# EAGLE design v0 (EAGLE 9.6.2)
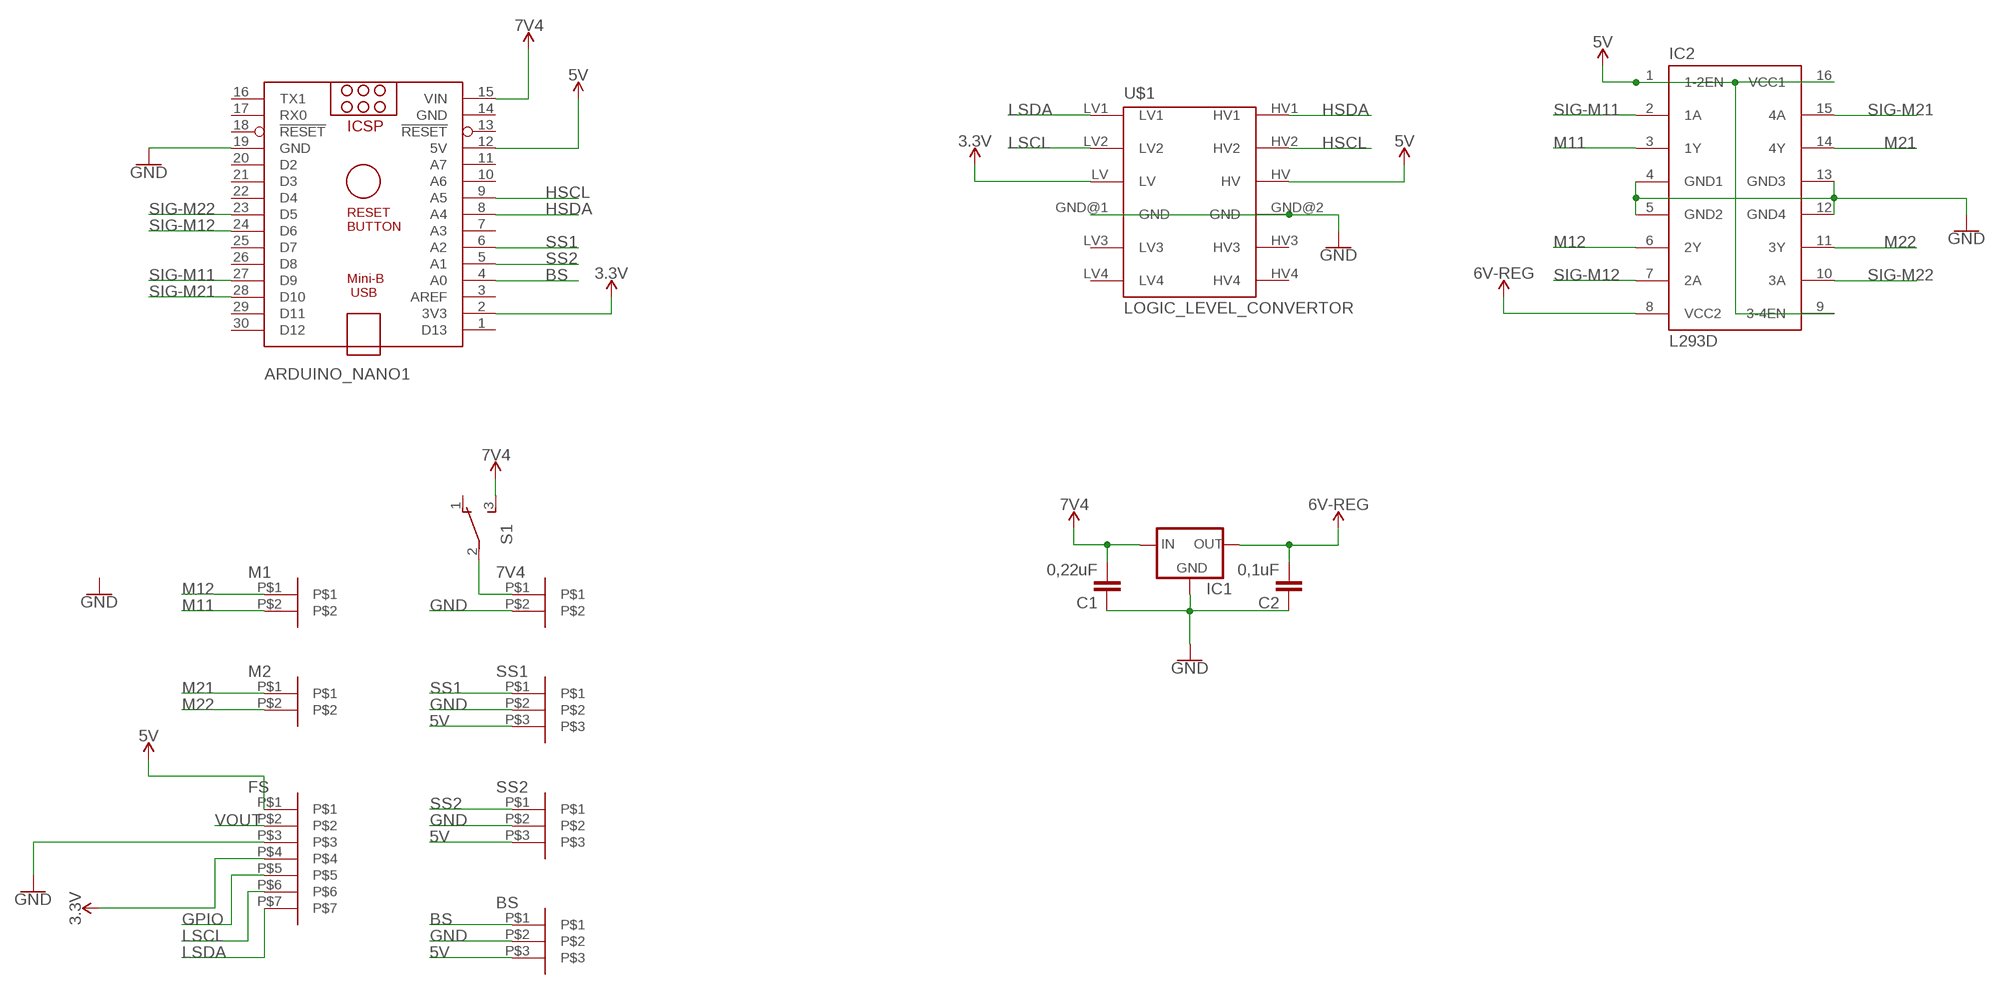
[diagram p0: schematic, sheet 1]

## Parts
7V4  2MM_JST_2  [2MM_JST_2]
ARDUINO_NANO1  ARDUINO_NANO  [ARDUINO_NANO]
BS  2MM_JST_3  [2MM_JST_3]
C1  0,22uF  C-EU050-025X075  [C050-025X075]
C2  0,1uF  C-EU050-025X075  [C050-025X075]
FS  2MM_JST_7  [2MM_JST_7]
IC1  78XXL  [78XXL]
IC2  L293D  [DIL16]
M1  2MM_JST_2  [2MM_JST_2]
M2  2MM_JST_2  [2MM_JST_2]
S1  TL36PO  [TL3XPO]
SS1  2MM_JST_3  [2MM_JST_3]
SS2  2MM_JST_3  [2MM_JST_3]
U$1  LOGIC_LEVEL_CONVERTOR  [LOGIC_LEVEL_CONVERTOR]

## Nets
3.3V: ARDUINO_NANO1.2(3V3) FS.P$4 U$1.LV
5V: ARDUINO_NANO1.12(5V) BS.P$3 FS.P$1 IC2.1(1-2EN) IC2.9(3-4EN) IC2.16(VCC1) SS1.P$3 SS2.P$3 U$1.HV
12V: C2.2 IC1.OUT IC2.8(VCC2) ; supply symbol labelled 6V-REG
BS: ARDUINO_NANO1.4(A0) BS.P$1
GND: 7V4.P$2 ARDUINO_NANO1.19(GND) BS.P$2 C1.1 C2.1 FS.P$3 IC1.GND IC2.4(GND1) IC2.5(GND2) IC2.12(GND4) IC2.13(GND3) SS1.P$2 SS2.P$2 U$1.GND@1(GND) U$1.GND@2(GND)
GPIO: FS.P$5
HSCL: ARDUINO_NANO1.9(A5) U$1.HV2
HSDA: ARDUINO_NANO1.8(A4) U$1.HV1
LSCL: FS.P$6 U$1.LV2
LSDA: FS.P$7 U$1.LV1
M11: IC2.3(1Y) M1.P$2
M12: IC2.6(2Y) M1.P$1
M21: IC2.14(4Y) M2.P$1
M22: IC2.11(3Y) M2.P$2
N$1: 7V4.P$1 S1.2(P)
SIG-M11: ARDUINO_NANO1.27(D9) IC2.2(1A)
SIG-M12: ARDUINO_NANO1.24(D6) IC2.7(2A)
SIG-M21: ARDUINO_NANO1.28(D10) IC2.15(4A)
SIG-M22: ARDUINO_NANO1.23(D5) IC2.10(3A)
SS1: ARDUINO_NANO1.6(A2) SS1.P$1
SS2: ARDUINO_NANO1.5(A1) SS2.P$1
VCCIO: ARDUINO_NANO1.15(VIN) C1.2 IC1.IN S1.3(S) ; supply symbol labelled 7V4
VOUT: FS.P$2
Unconnected: ARDUINO_NANO1.1(D13) ARDUINO_NANO1.3(AREF) ARDUINO_NANO1.7(A3) ARDUINO_NANO1.10(A6) ARDUINO_NANO1.11(A7) ARDUINO_NANO1.13(!RESET) ARDUINO_NANO1.16(TX1) ARDUINO_NANO1.17(RX0) ARDUINO_NANO1.18(!RESET) ARDUINO_NANO1.20(D2) ARDUINO_NANO1.21(D3) ARDUINO_NANO1.22(D4) ARDUINO_NANO1.25(D7) ARDUINO_NANO1.26(D8) ARDUINO_NANO1.29(D11) ARDUINO_NANO1.30(D12) S1.1(O) U$1.HV3 U$1.HV4 U$1.LV3 U$1.LV4

## Power pins joined to a net without a drawn wire
GND: ARDUINO_NANO1.14(GND)

## Library data of the parts
7V4 M1 M2 = JST:2MM_JST_2
ARDUINO_NANO1 = ArduinoNanoV30:ARDUINO_NANO: Arduino Nano V3.0 Overview: The Arduino Nano is a small, complete, and breadboard-friendly board based on the ATmega328 (Arduino Nano 3.x) or ATmega168 (Arduino Nano 2.x). It has more or less the same functionality of the Arduino Duemilanove, but in a different package. It lacks only a DC power jack, and works with a Mini-B USB cable instead of a standard one. The Nano was designed and is being produced by Gravitech. Specifications: Microcontroller Atmel ATmega168 or ATmega328 Operating Voltage (logic level) 5 V Input Voltage (recommended) 7-12 V Input Voltage (limits) 6-20 V Digital I/O Pins 14 (of which 6 provide PWM output) Analog Input Pins 8 DC Current per I/O Pin 40 mA Flash Memory 16 KB (ATmega168) or 32 KB (ATmega328) of which 2 KB used by bootloader SRAM 1 KB (ATmega168) or 2 KB (ATmega328) EEPROM 512 bytes (ATmega168) or 1 KB (ATmega328) Clock Speed 16 MHz Dimensions 0.73" x 1.70" Length 45 mm Width 18 mm Weigth 5 g Power: The Arduino Nano can be powered via the Mini-B USB connection, 6-20V unregulated external power supply (pin 30), or 5V regulated external power supply (pin 27). The power source is automatically selected to the highest voltage source. Memory: The ATmega168 has 16 KB of flash memory for storing code (of which 2 KB is used for the bootloader); the ATmega328 has 32 KB, (also with 2 KB used for the bootloader). The ATmega168 has 1 KB of SRAM and 512 bytes of EEPROM (which can be read and written with the EEPROM library); the ATmega328 has 2 KB of SRAM and 1 KB of EEPROM. Input and Output: Each of the 14 digital pins on the Nano can be used as an input or output, using pinMode(), digitalWrite(), and digitalRead() functions. They operate at 5 volts. Each pin can provide or receive a maximum of 40 mA and has an internal pull-up resistor (disconnected by default) of 20-50 kOhms. In addition, some pins have specialized functions. Visit Arduino - ArduinoBoardNano <https://www.arduino.cc/en/Main/ArduinoBoardNano>
BS SS1 SS2 = JST:2MM_JST_3
C1 C2 = rcl:C-EU: CAPACITOR, European symbol; SPICEPREFIX: C
FS = JST:2MM_JST_7
IC1 = v-reg:78XXL: VOLTAGE REGULATOR
IC2 = st-microelectronics:L293D: PUSH-PULL 4 CHANNEL DRIVER; MPN: L293D; OC_FARNELL: 9589619; OC_NEWARK: 56P8249
S1 = switch:TL36PO: TINY SWITCH ON - ON Source: http://www2.produktinfo.conrad.com/datenblaetter/700000-724999/705152-da-01-de-Subminiaturschalter_TL_36YO.pdf
U$1 = logic_level_convertor:LOGIC_LEVEL_CONVERTOR

## Board
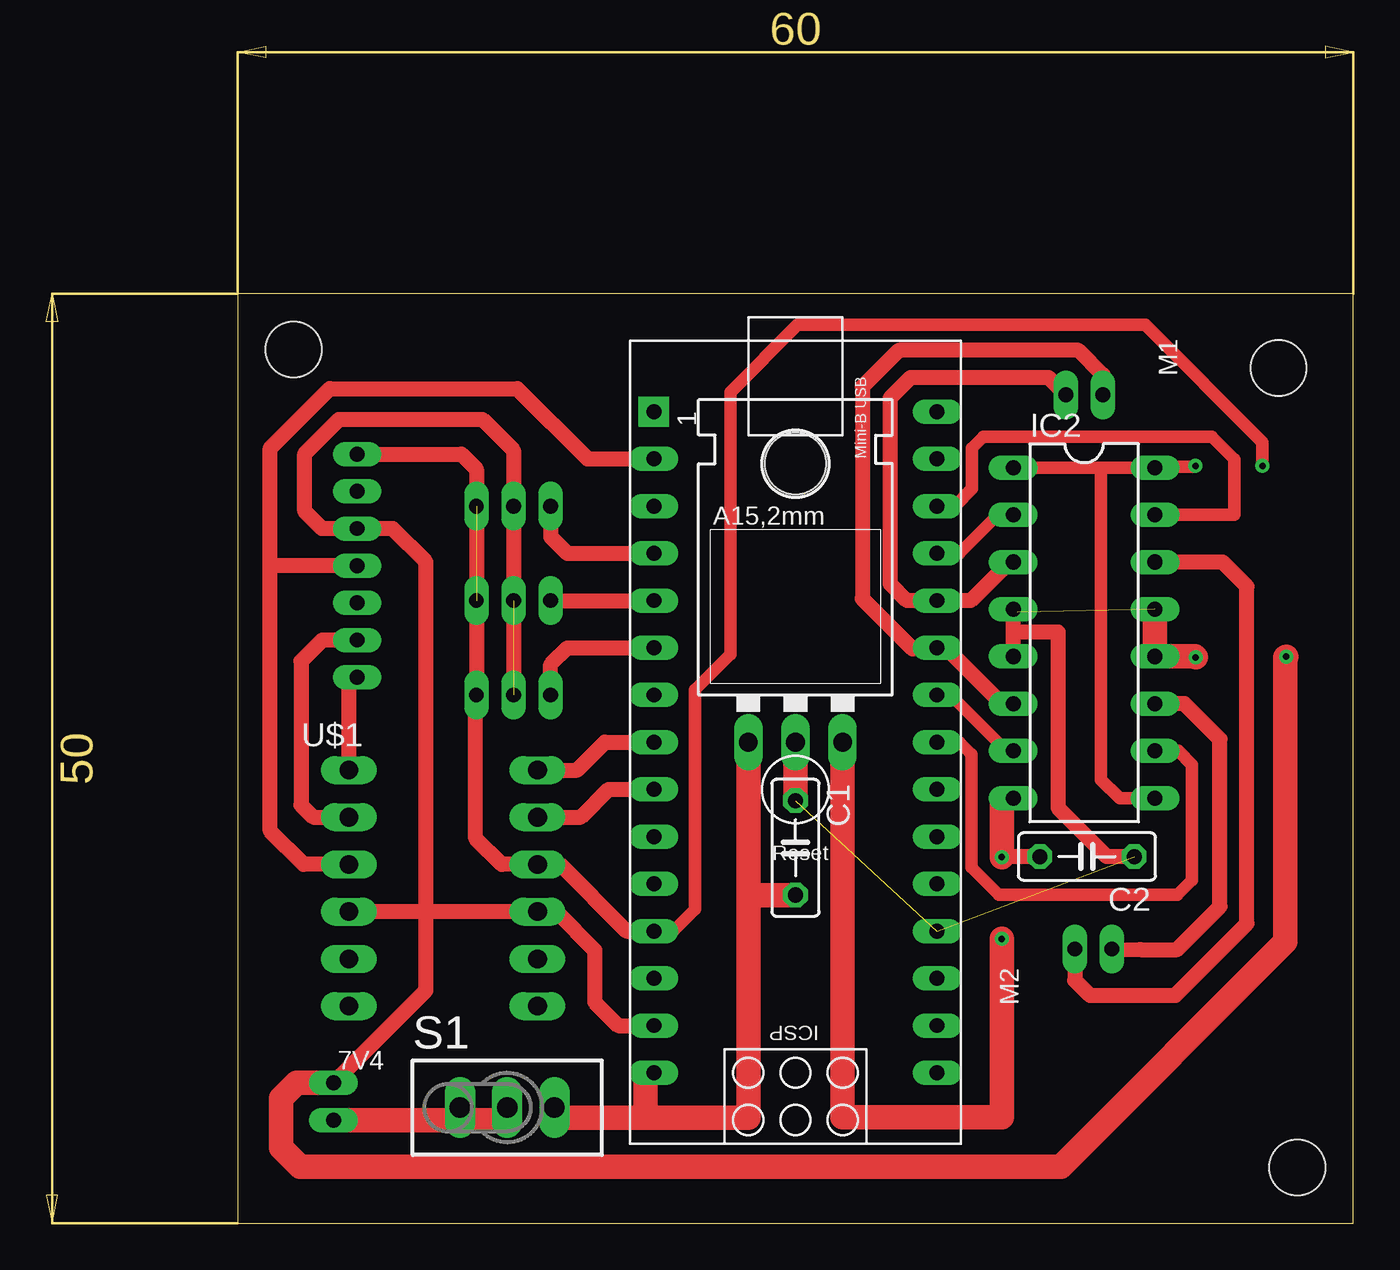
[diagram p1: board, top side]
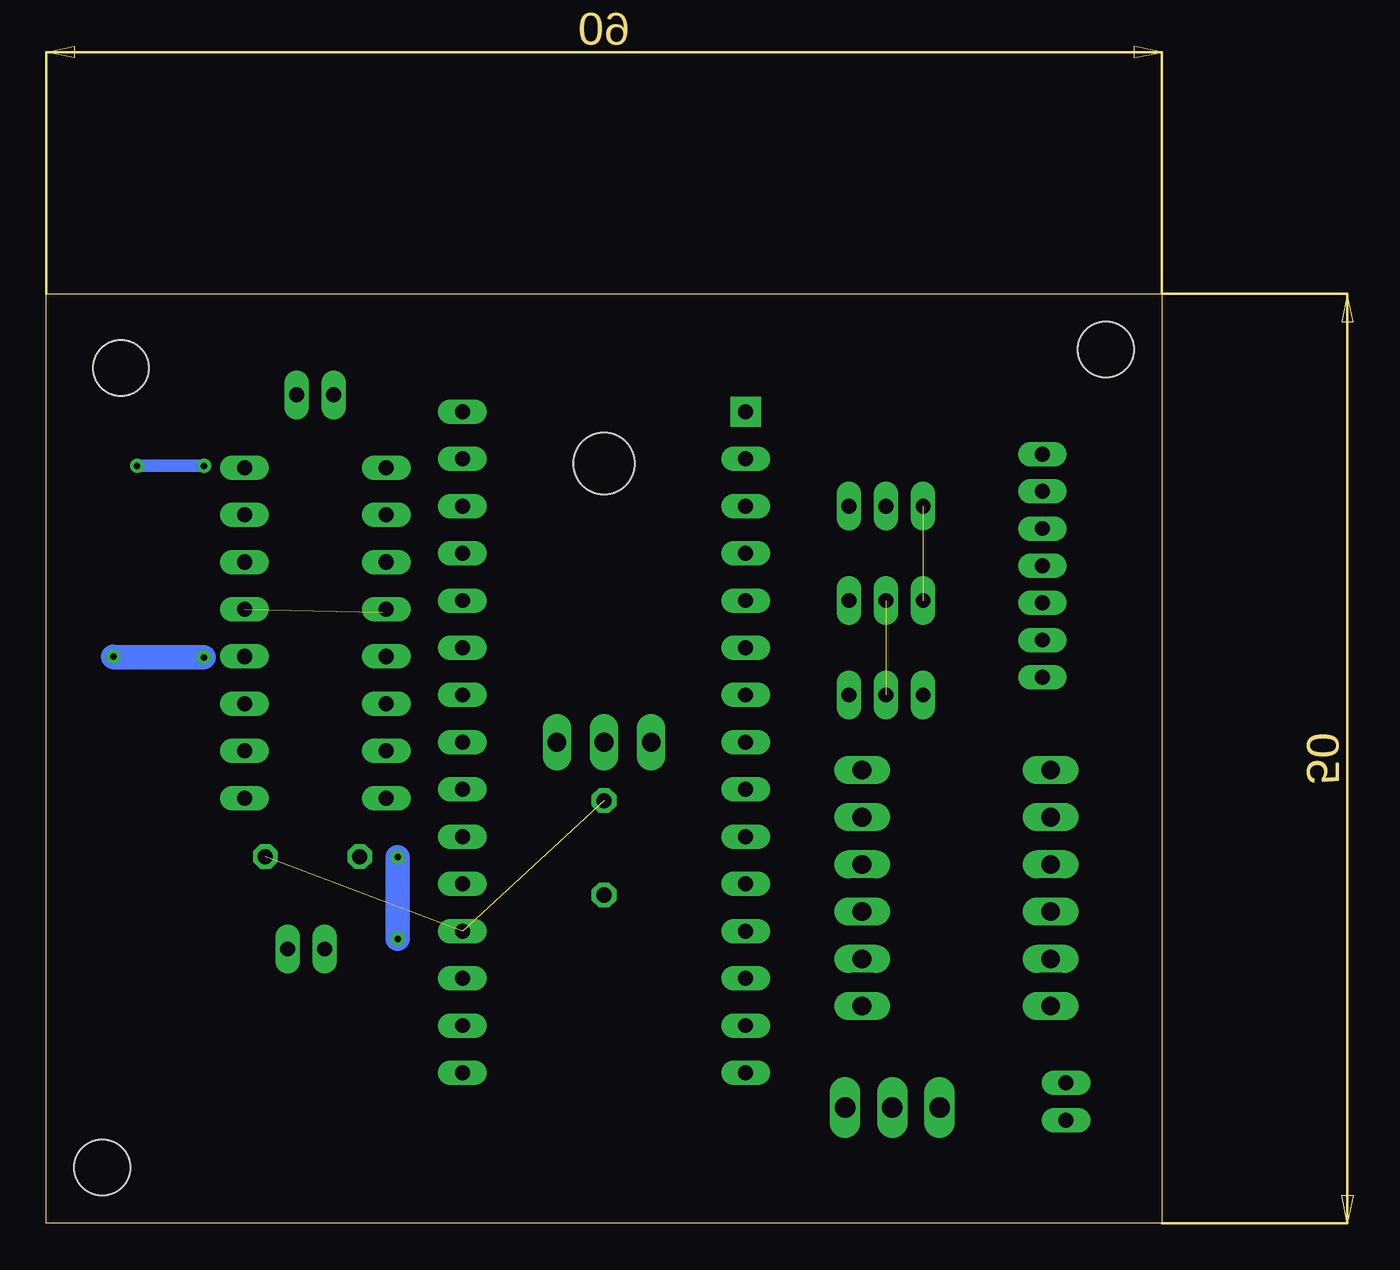
[diagram p2: board, bottom side, seen from below]

Size 60 x 50 mm. Coordinates in mm from the lower left corner, seen from the top.
Outline: 0,0 60,0 60,50 0,50 0,0
Copper layers (1*16): Top 0.035mm / dielectric 1.5mm / Bottom 0.035mm
Design rules "default": minimum track width 6mil, minimum drill 0.35mm, track to track 6mil, track to pad 6mil, pad to pad 6mil, via to via 6mil, smd to smd 6mil, copper to edge 40mil, drill to drill 6mil, minimum pad ring 10mil, minimum via ring 8mil, stop-mask expansion 4mil, vias tented up to drill 0mil, thermal gap 10mil
Holes 3 mm at 56,46 57,3 3,47

### Footprints (pad centres in the part's own frame; a part is rotated, then mirrored left to right if it is on the bottom)
2MM_JST_2 = drill 0.8 long: P$1 0,0; P$2 0,-2
ARDUINO_NANO = drill 0.8 pad 1.626 square: 1 -20.32,-7.62 | drill 0.8 long: 2 -17.78,-7.62; 3 -15.24,-7.62; 4 -12.7,-7.62; 5 -10.16,-7.62; 6 -7.62,-7.62; 7 -5.08,-7.62; 8 -2.54,-7.62; 9 0,-7.62; 10 2.54,-7.62; 11 5.08,-7.62; 12 7.62,-7.62; 13 10.16,-7.62; 14 12.7,-7.62; 15 15.24,-7.62; 16 15.24,7.62; 17 12.7,7.62; 18 10.16,7.62; 19 7.62,7.62; 20 5.08,7.62; 21 2.54,7.62; 22 0,7.62; 23 -2.54,7.62; 24 -5.08,7.62; 25 -7.62,7.62; 26 -10.16,7.62; 27 -12.7,7.62; 28 -15.24,7.62 | drill 0.8 pad 1.321 long: 29 -17.78,7.62; 30 -20.32,7.62
2MM_JST_3 = drill 0.8 long: P$1 0,0; P$2 0,-2; P$3 0,-4
C050-025X075 = drill 0.813 octagon: 1 -2.54,0; 2 2.54,0
2MM_JST_7 = drill 0.8 long: P$1 0,0; P$2 0,-2; P$3 0,-4; P$4 0,-6; P$5 0,-8; P$6 0,-10; P$7 0,-12
78XXL = drill 1.016 long: GND 0,-3.81; IN -2.54,-3.81; OUT 2.54,-3.81 | hole 3.302: 0,11.176
DIL16 = drill 0.813 long: 1 -8.89,-3.81; 2 -6.35,-3.81; 3 -3.81,-3.81; 4 -1.27,-3.81; 5 1.27,-3.81; 6 3.81,-3.81; 7 6.35,-3.81; 8 8.89,-3.81; 9 8.89,3.81; 10 6.35,3.81; 11 3.81,3.81; 12 1.27,3.81; 13 -1.27,3.81; 14 -3.81,3.81; 15 -6.35,3.81; 16 -8.89,3.81
TL3XPO = drill 1.1 pad 1.422 long: 1 -2.54,0; 2 0,0; 3 2.54,0
LOGIC_LEVEL_CONVERTOR = drill 1 long: GND@1 0,-7.62; GND@2 10.16,-7.62; HV 10.16,-5.08; HV1 10.16,0; HV2 10.16,-2.54; HV3 10.16,-10.16; HV4 10.16,-12.7; LV 0,-5.08; LV1 0,0; LV2 0,-2.54; LV3 0,-10.16; LV4 0,-12.7

### Placement (x,y rotation side)
7V4  5.15,5.55 180 top
ARDUINO_NANO1  30,23.34 270 top
BS  16.83,38.58 270 top
C1  30,20.2 270 top
C2  45.68,19.73 180 top
FS  6.42,41.37 0 top
IC1  30,29.69 0 top
IC2  45.53,31.76 270 top
M1  46.55,44.56 270 top
M2  45.02,14.75 90 top
S1  14.49,6.23 0 top
SS1  16.83,28.42 270 top
SS2  16.83,33.5 270 top
U$1  5.96,24.38 0 top

### Tracks (layer width: path | path; a pad name or v marks a point on that pad's centre or on a via)
3.3V
  Top 0.813: 1.74,35.4 1.74,41.7 4.94,44.9 15.03,44.9 18.81,41.12 ARDUINO_NANO1.2 | U$1.LV 3.54,19.3 1.74,21.1 1.74,35.4 | 1.74,35.4 1.77,35.37 FS.P$4
5V  (via drill 0.35)  (1 unrouted)
  Top 0.66: IC2.1 46.44,40.65 | 46.44,40.65 IC2.16 | 46.44,40.65 46.44,23.87 47.44,22.87 IC2.9 | ARDUINO_NANO1.12 23.42,15.72 24.6,16.9 24.6,28.7 26.5,30.6 26.5,44.7 30.12,48.32 48.82,48.32 55.12,42.02 v55.12,40.74 | IC2.16 47.46,40.65 | v51.52,40.74 51.47,40.69 49.38,40.69 IC2.16
  Top 0.813: ARDUINO_NANO1.12 20.91,15.72 17.33,19.3 U$1.HV 14.2,19.3 12.8,20.7 12.8,28.39 SS1.P$3 BS.P$3 12.83,40.57 12.03,41.37 FS.P$1
  Bottom 0.66: v51.52,40.74 v55.12,40.74
12V  (via drill 0.35)
  Top 0.813: C2.2 41.13,19.73 v41.1,19.7
  Top 1.321: IC2.8 41.1,22.87 v41.1,19.7 | v41.1,15.3 41.1,5.7 35,5.7 34.5,5.7 32.54,5.7 IC1.OUT
  Bottom 1.321: v41.1,19.7 v41.1,15.3
BS
  Top 0.813: ARDUINO_NANO1.4 17.71,36.04 16.83,36.92 BS.P$1
GND  (via drill 0.35)  (4 unrouted)
  Top 0.813: SS1.P$2 BS.P$2 14.83,41.57 13.16,43.24 5.44,43.24 3.6,41.4 3.6,38.3 4.53,37.37 FS.P$3 8.33,37.37 10.12,35.58 10.12,16.76 | ARDUINO_NANO1.14 20.46,10.64 19.2,11.9 19.2,14.7 17.14,16.76 U$1.GND@2 10.12,16.76 | 10.12,16.76 U$1.GND@1 | 7V4.P$2 10.12,12.53 10.12,16.76 | 41.95,32.87 IC2.4 41.72,31.8 | C2.1 46.75,19.73 44.12,22.36 44.12,31.8 41.72,31.8 | IC2.5 41.72,31.8
  Top 1.321: 7V4.P$2 3.15,7.55 2.34,6.74 2.34,4.08 3.36,3.06 44.28,3.06 56.36,15.14 56.36,30.44 v56.4,30.48 | IC2.13 IC2.12 51.49,30.49 v51.54,30.44 | C1.1 IC1.GND
  Bottom 1.321: v56.4,30.48 56.36,30.44 v51.54,30.44
HSCL
  Top 0.813: U$1.HV2 18.45,21.84 19.95,23.34 ARDUINO_NANO1.9
HSDA
  Top 0.813: U$1.HV1 18.25,24.38 19.75,25.88 ARDUINO_NANO1.8
LSCL
  Top 0.813: FS.P$6 4.53,31.37 3.4,30.24 3.4,22.5 4.06,21.84 U$1.LV2
LSDA
  Top 0.813: FS.P$7 5.96,28.92 U$1.LV1
M11
  Top 0.813: IC2.3 41.5,35.57 39.43,33.5 36,33.5 35.1,34.4 35.1,44.4 36.2,45.5 43.61,45.5 M1.P$2
M12
  Top 0.813: IC2.6 41.1,27.95 38.15,30.9 36.3,30.9 33.6,33.6 33.6,45 35.56,46.96 45.24,46.96 46.55,45.65 M1.P$1
M21
  Top 0.813: IC2.14 52.99,35.57 54.3,34.26 54.3,16.12 50.44,12.26 45.84,12.26 45.02,13.08 M2.P$1
M22
  Top 0.813: M2.P$2 48.55,14.72 50.52,14.72 52.84,17.04 52.84,26.04 50.93,27.95 IC2.11
N$1
  Top 1.321: S1.2 14.6,6.12 14.03,5.55 7V4.P$1
SIG-M11
  Top 0.66: ARDUINO_NANO1.27 38.81,36.04 40.88,38.11 IC2.2
SIG-M12
  Top 0.66: ARDUINO_NANO1.24 38.34,28.42 41.35,25.41 IC2.7
SIG-M21
  Top 0.66: 49.52,38.29 IC2.15 53.6,38.11 53.6,41.1 52.4,42.3 40.1,42.3 39.5,41.7 39.5,39.5 38.58,38.58 ARDUINO_NANO1.28
SIG-M22
  Top 0.66: IC2.10 50.59,25.41 51.32,24.68 51.32,18.46 50.54,17.68 40.94,17.68 39.46,19.16 39.46,25.24 38.82,25.88 ARDUINO_NANO1.23
SS1
  Top 0.813: ARDUINO_NANO1.6 17.73,30.96 16.83,30.06 SS1.P$1
SS2
  Top 0.813: SS2.P$1 ARDUINO_NANO1.5
VCCIO
  Top 1.321: S1.3 17.05,6.21 17.05,5.68 21.93,5.68 | ARDUINO_NANO1.15 21.93,8.08 21.93,5.68 | 21.93,5.68 27.46,5.68 27.46,17 27.46,17.66 | IC1.IN 27.46,17.66 | C1.2 27.46,17.66